# Altium schematic sheet PERIPHERAL_PORT_IO.SchDoc: Peripheral Port IO
size B; Engineer: M. Jones; Organization: Michael Jones; DocumentNumber: 5; Revision: RA.1; SheetNumber: 5; SheetTotal: 7
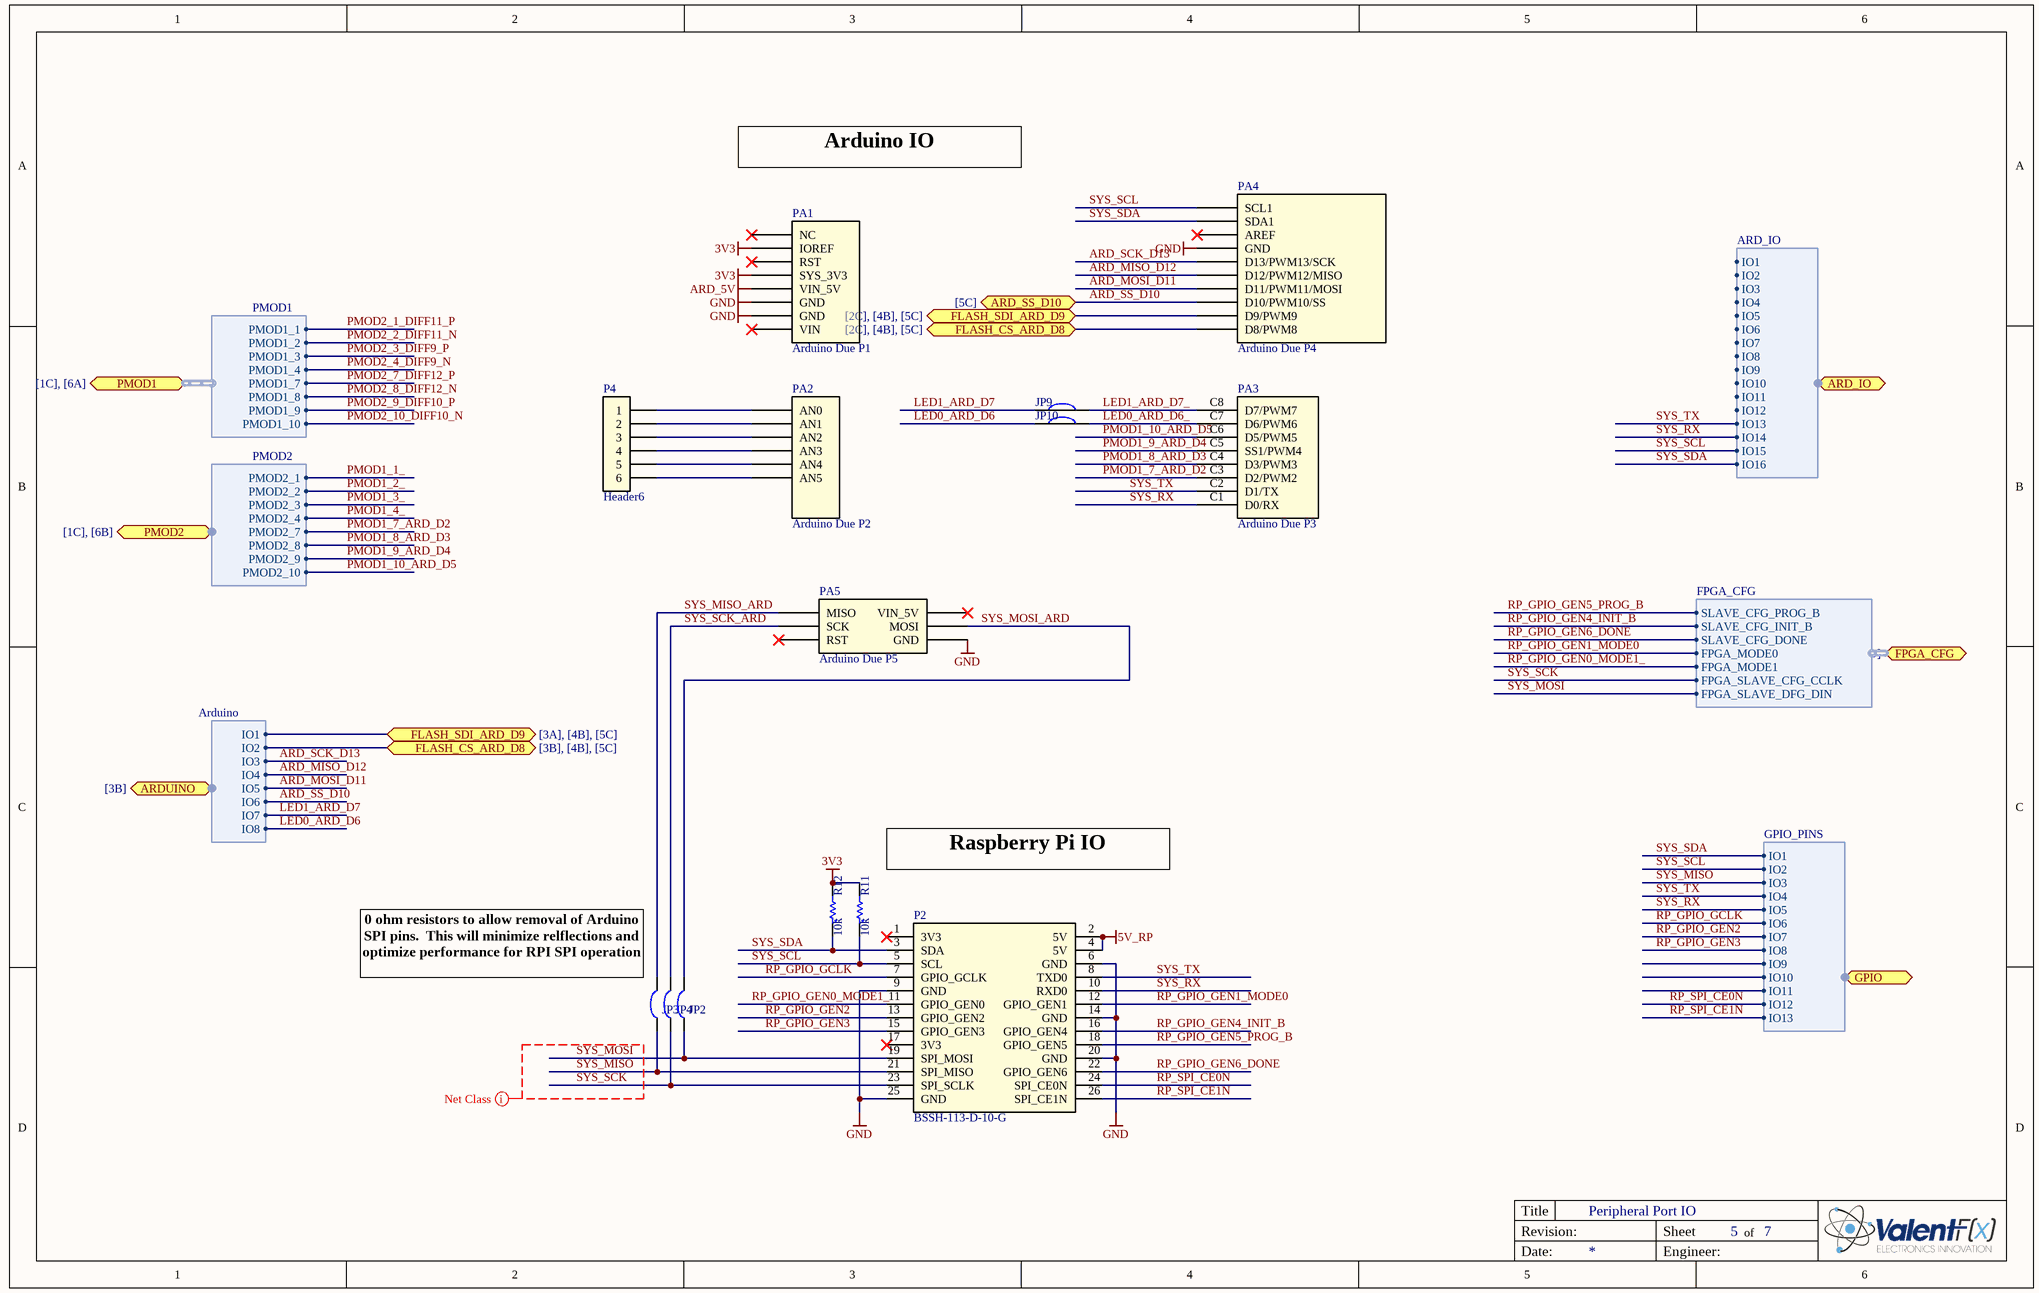
[diagram p0: PERIPHERAL_PORT_IO.SchDoc]

## Parts
JP2  Solder Jumper  [SOLDER_JUMPER]  (value not drawn)  (no BOM)
JP3  Solder Jumper  [SOLDER_JUMPER]  (value not drawn)  (no BOM)
JP4  Solder Jumper  [SOLDER_JUMPER]  (value not drawn)  (no BOM)
JP9  Solder Jumper-NC  [SOLDER_JUMPER-NC]  (value not drawn)  (net tie, no BOM)
JP10  Solder Jumper-NC  [SOLDER_JUMPER-NC]  (value not drawn)  (net tie, no BOM)
P2  BSSH-113-D-10-G  [Raspberr Pi - 26]
P4  Header6  [HEADER_6_40_100 THRU SIP]  (no BOM)
PA1  Arduino Due P1  [Arduino Due P1]
PA2  Arduino Due P2  [Arduino Due P2]
PA3  Arduino Due P3  [Arduino Due P3]
PA4  Arduino Due P4  [Arduino Due P4]
PA5  Arduino Due P5  [Arduino Due P5]  (no BOM)
R11  10k  [R0603]
R12  10k  [R0603]

## Ports
ARD_IO (harness ARD_IO, see [6A]), ARD_SS_D10 (see [5C]), ARDUINO (harness Arduino, see [3B]), FLASH_CS_ARD_D8 (see [2C], [4B], [5C]), FLASH_CS_ARD_D8 (see [3B], [4B], [5C]), FLASH_SDI_ARD_D9 (see [2C], [4B], [5C]), FLASH_SDI_ARD_D9 (see [3A], [4B], [5C]), FPGA_CFG (harness FPGA_CFG, see [1D]), GPIO (harness GPIO_PINS, see [1B]), PMOD1 (harness PMOD1, see [1C], [6A]), PMOD2 (harness PMOD2, see [1C], [6B])

## Harnesses
GPIO_PINS: IO3, IO4, IO5, IO6, IO7, IO8, IO9, IO10, IO11, IO12, IO13, IO1, IO2
FPGA_CFG: SLAVE_CFG_PROG_B, SLAVE_CFG_INIT_B, SLAVE_CFG_DONE, FPGA_MODE0, FPGA_MODE1, FPGA_SLAVE_CFG_CCLK, FPGA_SLAVE_DFG_DIN
ARD_IO: IO3, IO4, IO5, IO6, IO7, IO8, IO9, IO10, IO11, IO12, IO13, IO1, IO2, IO14, IO15, IO16
PMOD1: PMOD1_1, PMOD1_2, PMOD1_3, PMOD1_4, PMOD1_7, PMOD1_8, PMOD1_9, PMOD1_10
PMOD2: PMOD2_1, PMOD2_2, PMOD2_3, PMOD2_4, PMOD2_7, PMOD2_8, PMOD2_9, PMOD2_10
Arduino: IO1, IO2, IO3, IO4, IO5, IO6, IO7, IO8

## Nets
3V3: PA1.A2(IOREF) PA1.A4(SYS_3V3) R11.2 R12.2
5V_RP: P2.2(5V) P2.4(5V)
ARD_5V: PA1.A5(VIN_5V)
GND: P2.6(GND) P2.9(GND) P2.14(GND) P2.20(GND) P2.25(GND) PA1.A6(GND) PA1.A7(GND) PA4.D7(GND) PA5.E6(GND)
ARD_MISO_D12: PA4.D5(D12/PWM12/MISO) ; port ARDUINO.IO4
ARD_MOSI_D11: PA4.D4(D11/PWM11/MOSI) ; port ARDUINO.IO5
ARD_SCK_D13: PA4.D6(D13/PWM13/SCK) ; port ARDUINO.IO3
ARD_SS_D10: PA4.D3(D10/PWM10/SS) ; port ARD_SS_D10, port ARDUINO.IO6
FLASH_CS_ARD_D8: PA4.D1(D8/PWM8) ; port FLASH_CS_ARD_D8, port ARDUINO.IO2
FLASH_SDI_ARD_D9: PA4.D2(D9/PWM9) ; port FLASH_SDI_ARD_D9, port ARDUINO.IO1
LED0_ARD_D6: JP10.1 ; port ARDUINO.IO8
LED0_ARD_D6_: JP10.2 PA3.C7(D6/PWM6)
LED1_ARD_D7: JP9.1 ; port ARDUINO.IO7
LED1_ARD_D7_: JP9.2 PA3.C8(D7/PWM7)
PMOD1_1_: port PMOD2.PMOD2_1
PMOD1_2_: port PMOD2.PMOD2_2
PMOD1_3_: port PMOD2.PMOD2_3
PMOD1_4_: port PMOD2.PMOD2_4
PMOD1_7_ARD_D2: PA3.C3(D2/PWM2) ; port PMOD2.PMOD2_7
PMOD1_8_ARD_D3: PA3.C4(D3/PWM3) ; port PMOD2.PMOD2_8
PMOD1_9_ARD_D4: PA3.C5(SS1/PWM4) ; port PMOD2.PMOD2_9
PMOD1_10_ARD_D5: PA3.C6(D5/PWM5) ; port PMOD2.PMOD2_10
PMOD2_1_DIFF11_P: port PMOD1.PMOD1_1
PMOD2_2_DIFF11_N: port PMOD1.PMOD1_2
PMOD2_3_DIFF9_P: port PMOD1.PMOD1_3
PMOD2_4_DIFF9_N: port PMOD1.PMOD1_4
PMOD2_7_DIFF12_P: port PMOD1.PMOD1_7
PMOD2_8_DIFF12_N: port PMOD1.PMOD1_8
PMOD2_9_DIFF10_P: port PMOD1.PMOD1_9
PMOD2_10_DIFF10_N: port PMOD1.PMOD1_10
RP_GPIO_GCLK: P2.7(GPIO_GCLK) ; port GPIO.IO6
RP_GPIO_GEN0_MODE1_: P2.11(GPIO_GEN0) ; port FPGA_CFG.FPGA_MODE1
RP_GPIO_GEN1_MODE0: P2.12(GPIO_GEN1) ; port FPGA_CFG.FPGA_MODE0
RP_GPIO_GEN2: P2.13(GPIO_GEN2) ; port GPIO.IO7
RP_GPIO_GEN3: P2.15(GPIO_GEN3) ; port GPIO.IO8
RP_GPIO_GEN4_INIT_B: P2.16(GPIO_GEN4) ; port FPGA_CFG.SLAVE_CFG_INIT_B
RP_GPIO_GEN5_PROG_B: P2.18(GPIO_GEN5) ; port FPGA_CFG.SLAVE_CFG_PROG_B
RP_GPIO_GEN6_DONE: P2.22(GPIO_GEN6) ; port FPGA_CFG.SLAVE_CFG_DONE
RP_SPI_CE0N: P2.24(SPI_CE0N) ; port GPIO.IO12
RP_SPI_CE1N: P2.26(SPI_CE1N) ; port GPIO.IO13
SYS_MISO: JP3.1 P2.21(SPI_MISO) ; port GPIO.IO3
SYS_MISO_ARD: JP3.2 PA5.E1(MISO)
SYS_MOSI: JP2.1 P2.19(SPI_MOSI) ; port FPGA_CFG.FPGA_SLAVE_DFG_DIN
SYS_MOSI_ARD: JP2.2 PA5.E4(MOSI)
SYS_RX: P2.10(RXD0) PA3.C1(D0/RX) ; port GPIO.IO5, port ARD_IO.IO14
SYS_SCK: JP4.1 P2.23(SPI_SCLK) ; port FPGA_CFG.FPGA_SLAVE_CFG_CCLK
SYS_SCK_ARD: JP4.2 PA5.E3(SCK)
SYS_SCL: P2.5(SCL) PA4.D10(SCL1) R11.1 ; port GPIO.IO2, port ARD_IO.IO15
SYS_SDA: P2.3(SDA) PA4.D9(SDA1) R12.1 ; port GPIO.IO1, port ARD_IO.IO16
SYS_TX: P2.8(TXD0) PA3.C2(D1/TX) ; port GPIO.IO4, port ARD_IO.IO13
NetP4_1: P4.1 PA2.B1(AN0)
NetP4_2: P4.2 PA2.B2(AN1)
NetP4_3: P4.3 PA2.B3(AN2)
NetP4_4: P4.4 PA2.B4(AN3)
NetP4_5: P4.5 PA2.B5(AN4)
NetP4_6: P4.6 PA2.B6(AN5)

Not connected (* = marked no-connect by the designer): P2 1(3V3)* 17(3V3)*; PA1 A1(NC)* A3(RST)* A8(VIN)*; PA4 D8(AREF)*; PA5 E2(VIN_5V)* E5(RST)*

## Layout directives
net class SPI: SYS_MISO, SYS_MOSI, SYS_SCK

## Notes on the sheet
- Arduino IO
- Raspberry Pi IO
- 0 ohm resistors to allow removal of Arduino SPI pins.  This will minimize relflections and optimize performance for RPI SPI operation
- Title
- Revision:
- Sheet
- of
- Date:
- Engineer:

## Library data of the parts
JP2-JP4 = Solder Jumper: Solder/Configuration Jumper; Manufacturer: n/a; Manufacturer Part Number: n/a; Source: n/a; Source Part Number: n/a; ROHS Certificate: n/a
JP9 JP10 = Solder Jumper-NC: Solder/Configuration Jumper; Manufacturer: n/a; Manufacturer Part Number: n/a; Source: n/a; Source Part Number: n/a; ROHS Certificate: n/a
P2 = Raspberry Pi - 26: Manufacturer: Major League Electroncis; Datasheet: http://s3.amazonaws.com/mlkelly/productMedia/BSSH-1/BSSH-1-D-Datasheet.pdf; Price1: 1.95; Value: BSSH-113-D-10-G; Supplier 1: Adafruit; Supplier Part Number 1: BSSH-113-D-10-G; Manufacturer Part Number: BSSH-113-D-10-G
P4 = Header6: Header 6 pin
PA1 = Arduino Due P1: CONN HEADER FEMALE 8POS .1" GOLD; Manufacturer: Sullins Connector Solutions; Manufacturer Part Number: PPPC081LFBN-RC; Number of Positions: 8; Number of Positions Loaded: All; Pitch: 0.100" (2.54mm); Supplier 1: Digi-Key; RoHS: RoHS Compliant; Category: Connectors, Interconnects; Stock 1: 30245; Pricing 1: 1=0.89, 10=0.69, 25=0.6436, 50=0.585, 100=0.5265, 250=0.4446, 500=0.4212, 1000=0.3744, 2500=0.31122 (USD); Packaging: Bulk; Connector Type: Header; Contact Type: Female Socket; Number of Rows: 1; Row Spacing: -; Mounting Type: Through Hole; Termination: Solder; Fastening Type: -; Features: -; Contact Finish: Gold; Contact Finish Thickness: Flash; Color: Black; ComponentLink1URL: http://www.sullinscorp.com/drawings/78_P(N)PxCxxxLFBN-RC,_10492-G.pdf; ComponentLink1Description: http://www.sullinscorp.com/drawings/78_P(N)PxCxxxLFBN-RC,_10492-G.pdf; Supplier Part Number 1: S7041-ND
PA2 = Arduino Due P2: CONN HEADER FEMALE 6POS .1" GOLD; Manufacturer: Sullins Connector Solutions; Manufacturer Part Number: PPPC061LFBN-RC; Number of Positions: 6; Number of Positions Loaded: All; Pitch: 0.100" (2.54mm); Supplier 1: Digi-Key; RoHS: RoHS Compliant; Category: Connectors, Interconnects; Stock 1: 9213; Pricing 1: 1=0.7, 10=0.546, 25=0.5088, 50=0.4626, 100=0.4163, 250=0.35152, 500=0.333, 1000=0.296, 2500=0.24605 (USD); Packaging: Bulk; Connector Type: Header; Contact Type: Female Socket; Number of Rows: 1; Row Spacing: -; Mounting Type: Through Hole; Termination: Solder; Fastening Type: -; Features: -; Contact Finish: Gold; Contact Finish Thickness: Flash; Color: Black; ComponentLink1URL: http://www.sullinscorp.com/drawings/78_P(N)PxCxxxLFBN-RC,_10492-G.pdf; ComponentLink1Description: http://www.sullinscorp.com/drawings/78_P(N)PxCxxxLFBN-RC,_10492-G.pdf; Supplier Part Number 1: S7039-ND
PA3 = Arduino Due P3: CONN HEADER FEMALE 8POS .1" GOLD; Manufacturer: Sullins Connector Solutions; Manufacturer Part Number: PPPC081LFBN-RC; Number of Positions: 8; Number of Positions Loaded: All; Pitch: 0.100" (2.54mm); Supplier 1: Digi-Key; RoHS: RoHS Compliant; Category: Connectors, Interconnects; Stock 1: 30245; Pricing 1: 1=0.89, 10=0.69, 25=0.6436, 50=0.585, 100=0.5265, 250=0.4446, 500=0.4212, 1000=0.3744, 2500=0.31122 (USD); Packaging: Bulk; Connector Type: Header; Contact Type: Female Socket; Number of Rows: 1; Row Spacing: -; Mounting Type: Through Hole; Termination: Solder; Fastening Type: -; Features: -; Contact Finish: Gold; Contact Finish Thickness: Flash; Color: Black; ComponentLink1URL: http://www.sullinscorp.com/drawings/78_P(N)PxCxxxLFBN-RC,_10492-G.pdf; ComponentLink1Description: http://www.sullinscorp.com/drawings/78_P(N)PxCxxxLFBN-RC,_10492-G.pdf; Supplier Part Number 1: S7041-ND
PA4 = Arduino Due P4: CONN HEADER FMALE 10POS .1" GOLD; Manufacturer: Sullins Connector Solutions; Manufacturer Part Number: PPPC101LFBN-RC; Number of Positions: 10; Number of Positions Loaded: All; Pitch: 0.100" (2.54mm); Supplier 1: Digi-Key; RoHS: RoHS Compliant; Category: Connectors, Interconnects; Stock 1: 5570; Pricing 1: 1=0.84, 10=0.699, 25=0.6476, 50=0.5828, 100=0.518, 250=0.45324, 500=0.4144, 1000=0.37555, 2500=0.3367 (USD); Packaging: Bulk; Connector Type: Header; Contact Type: Female Socket; Number of Rows: 1; Row Spacing: -; Mounting Type: Through Hole; Termination: Solder; Fastening Type: -; Features: -; Contact Finish: Gold; Contact Finish Thickness: Flash; Color: Black; ComponentLink1URL: http://www.sullinscorp.com/drawings/78_P(N)PxCxxxLFBN-RC,_10492-G.pdf; ComponentLink1Description: http://www.sullinscorp.com/drawings/78_P(N)PxCxxxLFBN-RC,_10492-G.pdf; Supplier Part Number 1: S7043-ND
R11 R12 = R0603 - CRCW060310K0FKEA: 10k Thick Film Resistors - SMD 1/10watt 10Kohms 1%; Manufacturer: Vishay Dale; Power (Watts): 0.1W, 1/10W; Temperature Coefficient: ±100ppm/°C; Manufacturer Part Number: CRCW060310K0FKEA; Value: 10k; Supplier 1: Digi-Key; RoHS: RoHS Compliant; Category: Resistors; Stock 1: 997856; Pricing 1: 10=0.081, 50=0.0436, 200=0.0251, 1000=0.01711 (USD); Resistance (Ohms): 10K; Composition: Thick Film; Features: -; Tolerance: ±1%; Size / Dimension: 0.061" L x 0.033" W (1.55mm x 0.85mm); Height: 0.020" (0.50mm); Packaging: Cut Tape (CT); Package / Case: 0603 (1608 Metric); ComponentLink1URL: http://www.vishay.com/doc?20035; ComponentLink1Description: http://www.vishay.com/doc?20035; Supplier Part Number 1: 541-10.0KHCT-ND; Number of Terminations: 2